# Altium project Zapper.PrjPcb (part 3 of 3)

## Sheet Filter.SchDoc
size A4; DocumentNumber: 7; SheetNumber: 7; SheetTotal: 7
Used 4 times, as channels U_Filter1, U_Filter2, U_Filter3, U_Filter4. Parts and nets are listed once, with the designators drawn on the sheet.
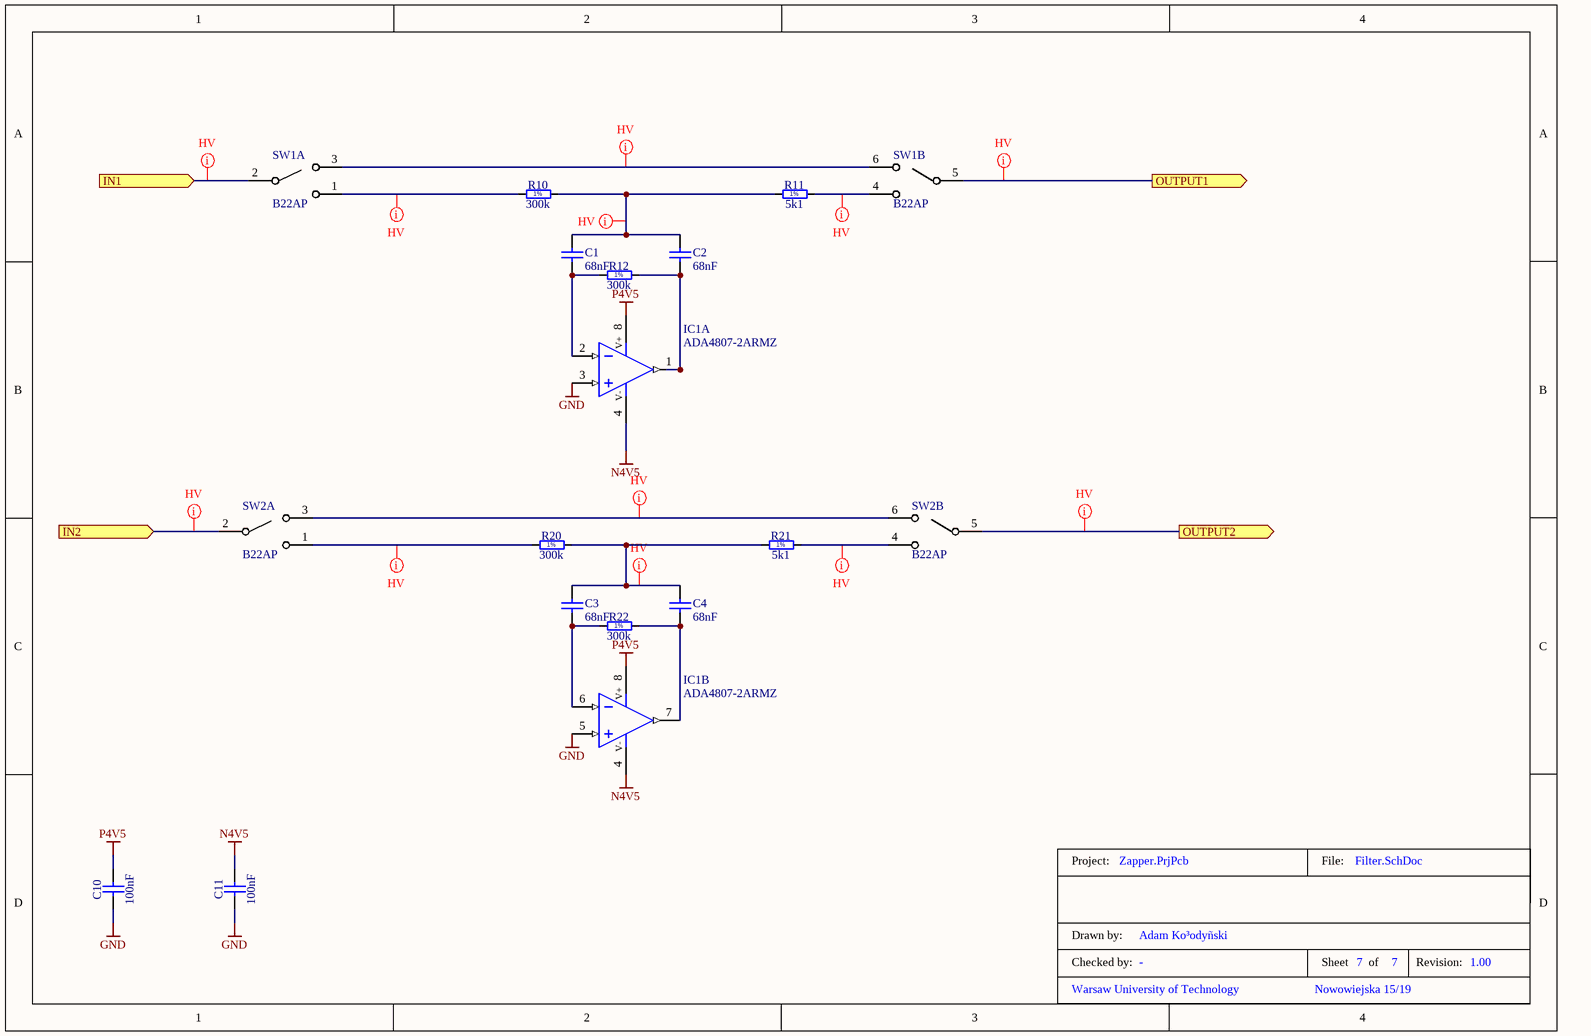
[diagram p6: Filter.SchDoc]

### Parts
C1  68nF  [CAPC2012X125 - HV]
C2  68nF  [CAPC2012X125 - HV]
C3  68nF  [CAPC2012X125 - HV]
C4  68nF  [CAPC2012X125 - HV]
C10  100nF  [CAPC1005X55N]
C11  100nF  [CAPC1005X55N]
IC1  ADA4807-2ARMZ  [SOP65P490X110-8N]  (parts A,B of 2)
R10  300k  [RESC2012X60N]
R11  5k1  [RESC1608X55N]
R12  300k  [RESC2012X60N]
R20  300k  [RESC2012X60N]
R21  5k1  [RESC1608X55N]
R22  300k  [RESC2012X60N]
SW1  B22AP  [B22AP]  (parts A,B of 2)
SW2  B22AP  [B22AP]  (parts A,B of 2)
TitleBlock7  TitleBlock  (value not drawn)  (graphical)

### Ports
IN1 (in), IN2 (in), OUTPUT1 (out), OUTPUT2 (out)

### Nets
GND: C10.1 C11.1 IC1.3(IN+) IC1.5(IN+)
N4V5: C11.2 IC1.4(V-)
P4V5: C10.2 IC1.8(V+)
IN1: SW1.2(COM) ; port IN1
IN2: SW2.2(COM) ; port IN2
OUTPUT1: SW1.5(COM) ; port OUTPUT1
OUTPUT2: SW2.5(COM) ; port OUTPUT2
NetC1_1: C1.1 IC1.2(IN-) R12.1
NetC1_2: C1.2 C2.2 R10.2 R11.1
NetC2_1: C2.1 IC1.1(OUT) R12.2
NetC3_1: C3.1 IC1.6(IN-) R22.1
NetC3_2: C3.2 C4.2 R20.2 R21.1
NetC4_1: C4.1 IC1.7(OUT) R22.2
NetR10_1: R10.1 SW1.1(UP)
NetR11_2: R11.2 SW1.4(UP)
NetR20_1: R20.1 SW2.1(UP)
NetR21_2: R21.2 SW2.4(UP)
NetSW1_3: SW1.3(DOWN) SW1.6(DOWN)
NetSW2_3: SW2.3(DOWN) SW2.6(DOWN)

### Channels
U_Filter1: designators end in _U_Filter1; ports IN1=Channel_OUT1 IN2=Channel_OUT2 OUTPUT1=Filter_OUT1 OUTPUT2=Filter_OUT2
U_Filter2: designators end in _U_Filter2; ports IN1=Channel_OUT3 IN2=Channel_OUT4 OUTPUT1=Filter_OUT3 OUTPUT2=Filter_OUT4
U_Filter3: designators end in _U_Filter3; ports IN1=Channel_OUT5 IN2=Channel_OUT6 OUTPUT1=Filter_OUT5 OUTPUT2=Filter_OUT6
U_Filter4: designators end in _U_Filter4; ports IN1=Channel_OUT7 IN2=Channel_OUT8 OUTPUT1=Filter_OUT7 OUTPUT2=Filter_OUT8

### Layout directives
net class HighVoltage: Channel_OUT1, Channel_OUT2, Filter_OUT1, Filter_OUT2, NetC1_U_Filter1_2, NetC3_U_Filter1_2, NetR10_U_Filter1_1, NetR11_U_Filter1_2, NetR20_U_Filter1_1, NetR21_U_Filter1_2, NetSW1_U_Filter1_3, NetSW2_U_Filter1_3

### Notes on the sheet
- (in symbol R0603_5K1_1%_0.1W_100PPM) 1%
- (in symbol R0805_300K_1%_0.125W_100PPM) 1%
- (in symbol TitleBlock) Project:; File:; Drawn by:; Checked by:; Sheet; of; Revision:

### Library data of the parts
C1-C4 = C0805C683KARACAUTO: CAP CER 68nF 250V X7R 10% Pad SMD 0805 125C Automotive T/R; Manufacturer 1: KEMET; Supplier 1: Digi-Key; Manufacturer Part Number 1: C0805C683KARACAUTO; Stock 1: 7245; Pricing 1: 1=0,94000, 10=0,71800, 50=0,59660, 100=0,51370, 500=0,39772, 1000=0,34247 (USD); RoHS: No; Mount: Surface Mount; Case/Package: 0805; Case Code (Imperial): 0805; Case Code (Metric): 2012; Min Operating Temperature: -55°C; Max Operating Temperature: 125°C; Packaging: Tape and Reel; Capacitance: 68nF; Tolerance: 10%; Voltage Rating: 250V; Ratings: AEC-Q200; ComponentLink1URL: https://api.kemet.com/component-edge/download/datasheet/C0805C683KARACAUTO.pdf?src-supplier=Digi-Key; ComponentLink1Description: https://api.kemet.com/component-edge/download/datasheet/C0805C683KARACAUTO.pdf?src-supplier=Digi-Key; ComponentLink2URL: http://www.farnell.com/datasheets/2621747.pdf?src-supplier=Newark; ComponentLink2Description: http://www.farnell.com/datasheets/2621747.pdf?src-supplier=Newark; Supplier Part Number 1: 399-17963-1-ND
C10 C11 = CC0402_100NF_16V_10%_X7R: Non-polarised capacitor; Part Description: SMD Multilayer Chip Ceramic Capacitor; Manufacturer: GENERIC; Manufacturer1 Part Number: GRM155R71C104KA88D; Voltage: 16V; TC: X7R; Tolerance: ±10%; Part Number: CC0402_100NF_16V_10%_X7R; Component Kind: Standard; Component Type: Standard; Pin Count: 2; Value: 100nF; Status: Not Recommended; Manufacturer Part Number: CC0402_100NF_16V_10%_X7R; Case: 0402; Mounted: Yes; Socket: No; SMD: Yes; Sense: No; Manufacturer1 Example: MURATA; Manufacturer1 ComponentHeight: 0.55mm; HelpURL: \\cern.ch\dfs\Applications\Altium\Datasheets\CC0402_X7R_MURATA_GRM.pdf; Author: CERN DEM JLC; CreateDate: 05.12.2013; LatestRevisionDate: 03.12.2007
IC1 = ADA4807-2ARMZ: Operational Amplifier, 180 Mhz, 2, 225 V/ S, 2.7V To 11V, Msop, 8; Manufacturer 1: Analog Devices; Power Supply Rejection Ratio (PSRR): 98dB; Min Supply Voltage: 3V; Voltage Gain: 130dB; Max Supply Voltage: 10V; Max Dual Supply Voltage: 5V; Common Mode Rejection Ratio: 110dB; Min Dual Supply Voltage: 1.5V; Number of Circuits: 2; Slew Rate: 145V/µs; -3db Bandwidth: 170MHz; Input Bias Current: 1.2uA; Input Offset Voltage (Vos): 20uV; Operating Supply Current: 950uA; Output Current per Channel: 106mA; Max Frequency: 100kHz; Gain Bandwidth Product: 180MHz; Output Current: 60mA; Supplier 1: Digi-Key; Manufacturer Part Number 1: ADA4807-2ARMZ; Stock 1: 0; Pricing 1: 1=4,74000, 10=4,26000, 25=4,02760, 100=3,31150, 250=2,97140, 500=2,86400, 1000=2,59550 (USD); RoHS: Yes; Mount: Surface Mount; Case/Package: MSOP; Number of Pins: 8; Contact Plating: Tin,Matte; Min Operating Temperature: -40°C; Max Operating Temperature: 125°C; Packaging: Tray; Max Input Voltage: 11V; Min Input Voltage: 2.7V; Bandwidth: 180MHz; Number of Amplifiers: 2; Length: 3.2mm; Height: 0.95mm; Width: 3.2mm; Lead Free: Contains Lead; REACH SVHC: No SVHC; ComponentLink1URL: http://www.mouser.com/ds/2/609/ADA4807-1_4807-2_4807-4-773557.pdf?src-supplier=Mouser; ComponentLink1Description: http://www.mouser.com/ds/2/609/ADA4807-1_4807-2_4807-4-773557.pdf?src-supplier=Mouser; ComponentLink2URL: http://uk.rs-online.com/webdocs/143c/0900766b8143cfda.pdf?src-supplier=RSComponents; ComponentLink2Description: http://uk.rs-online.com/webdocs/143c/0900766b8143cfda.pdf?src-supplier=RSComponents; ComponentLink3URL: http://www.farnell.com/datasheets/1971065.pdf?src-supplier=Farnell; ComponentLink3Description: http://www.farnell.com/datasheets/1971065.pdf?src-supplier=Farnell; ComponentLink4URL: http://www.analog.com/media/en/technical-documentation/data-sheets/ADA4807-1_4807-2.pdf?src-supplier=Avnet; ComponentLink4Description: http://www.analog.com/media/en/technical-documentation/data-sheets/ADA4807-1_4807-2.pdf?src-supplier=Avnet; ComponentLink5URL: http://www.farnell.com/datasheets/1971065.pdf?src-supplier=Newark; ComponentLink5Description: http://www.farnell.com/datasheets/1971065.pdf?src-supplier=Newark; ComponentLink6URL: https://www.analog.com/media/en/technical-documentation/data-sheets/ADA4807-1_4807-2_4807-4.pdf?src-supplier=Digi-Key; ComponentLink6Description: https://www.analog.com/media/en/technical-documentation/data-sheets/ADA4807-1_4807-2_4807-4.pdf?src-supplier=Digi-Key; ComponentLink7URL: http://www.farnell.com/datasheets/1971065.pdf?src-supplier=Element14; ComponentLink7Description: http://www.farnell.com/datasheets/1971065.pdf?src-supplier=Element14; Supplier Part Number 1: ADA4807-2ARMZ-ND
R10 R12 R20 R22 = R0805_300K_1%_0.125W_100PPM: Resistor - 1%; Part Description: General Purpose Thick Film Chip Resistor; Manufacturer: GENERIC; Manufacturer1 Part Number: NRC10F3003TRF; Power: 0.125W; TC: ±100ppm/°C; PressFit: No; Part Number: R0805_300K_1%_0.125W_100PPM; Component Kind: Standard; Component Type: Standard; Pin Count: 2; Value: 300k; Status: Preferred; Tolerance: ±1%; Manufacturer Part Number: R0805_300K_1%_0.125W_100PPM; Case: 0805; Mounted: Yes; Sense: No; Socket: No; SMD: Yes; Manufacturer1 Example: NIC COMPONENT; Manufacturer1 ComponentHeight: 0.6mm; HelpURL: \\cern.ch\dfs\Applications\Altium\Datasheets\R0805_NIC_NRC.pdf; Author: CERN DEM JLC; CreateDate: 03.12.2007; LatestRevisionDate: 13.03.2008
R11 R21 = R0603_5K1_1%_0.1W_100PPM: Resistor - 1%; Part Description: General Purpose Thick Film Chip Resistor; Manufacturer: GENERIC; Manufacturer1 Part Number: NRC06F5101TRF; Power: 0.1W; TC: ±100ppm/°C; PressFit: No; Part Number: R0603_5K1_1%_0.1W_100PPM; Component Kind: Standard; Component Type: Standard; Pin Count: 2; Value: 5k1; Status: Preferred; Tolerance: ±1%; Manufacturer Part Number: R0603_5K1_1%_0.1W_100PPM; Case: 0603; Mounted: Yes; Sense: No; Socket: No; SMD: Yes; Manufacturer1 Example: NIC COMPONENT; Manufacturer1 ComponentHeight: 0.55mm; HelpURL: \\cern.ch\dfs\Applications\Altium\Datasheets\R0603_NIC_NRC.pdf; Author: CERN DEM JLC; CreateDate: 03.12.2007; LatestRevisionDate: 13.03.2008
SW1 SW2 = B22AP: NKK SWITCHES         B22AP            SWITCH, TOGGLE, DPDT, 0.1A, 28VAC; Actuator Material: Brass; Current Rating: 100mA; Switch Function: On-On; Illumination Type: Non-Illuminated,Illuminated; Electrical Life: 50000Cycles; Power Rating: 400mW; Voltage Rating (AC): 28V; Actuator Type: Standard Round; Actuator Length: 10mm; Supplier 1: Digi-Key; Manufacturer 1: NKK Switches; Manufacturer Part Number 1: B22AP; Stock 1: 24; Pricing 1: 1=4,45000, 10=3,97400, 25=3,76320, 50=3,62880, 100=3,45600, 250=3,30240, 500=3,01440, 1000=2,88000 (USD); RoHS: Yes; Mount: Through Hole,PCB; Number of Pins: 1; Contact Plating: Nickel,Gold; Contact Material: Bronze,Gold; Min Operating Temperature: -30°C; Max Operating Temperature: 85°C; Package Quantity: 1; Packaging: Bulk; Termination: Solder; Throw Configuration: DPDT; Orientation: Vertical; Voltage Rating (DC): 28V; Max Current Rating: 100mA; Max Voltage Rating (AC): 28V; Max Voltage Rating (DC): 28V; Contact Current Rating: 100mA; Length: 8.8mm; Depth: 8.8mm; Lead Free: Lead Free; REACH SVHC: No SVHC; ComponentLink1URL: https://datasheet.ciiva.com/15183/getdatasheetpartid-54702-15183244.pdf?src-supplier=Verical; ComponentLink1Description: https://datasheet.ciiva.com/15183/getdatasheetpartid-54702-15183244.pdf?src-supplier=Verical; ComponentLink2URL: https://datasheet.ciiva.com/28398/1672172-28398222.pdf?src-supplier=Element14; ComponentLink2Description: https://datasheet.ciiva.com/28398/1672172-28398222.pdf?src-supplier=Element14; ComponentLink3URL: https://datasheet.ciiva.com/29337/702702-da-01-en-kipphebels-dpdt-on-on-10mm-ger-anschl-29337834.pdf?src-supplier=Conrad; ComponentLink3Description: https://datasheet.ciiva.com/29337/702702-da-01-en-kipphebels-dpdt-on-on-10mm-ger-anschl-29337834.pdf?src-supplier=Conrad; Supplier Part Number 1: 360-1015-ND; Supplier 2: Mouser; Supplier Part Number 2: 633-B22AP

## Nets that join several sheets
GND: Zapper (13 pins), LVDS (44 pins), DAC_8CH (28 pins), U_SCHMITT_LED1 (10 pins), U_SCHMITT_LED2 (10 pins), U_OutputChannel1 (15 pins), U_OutputChannel2 (15 pins), U_OutputChannel3 (15 pins), U_OutputChannel4 (15 pins), U_OutputChannel5 (15 pins), U_OutputChannel6 (15 pins), U_OutputChannel7 (15 pins), U_OutputChannel8 (15 pins), PowerSupp (48 pins), U_Filter1 (C10_U_Filter1.1 C11_U_Filter1.1 IC1_U_Filter1.3 IC1_U_Filter1.5), U_Filter2 (C10_U_Filter2.1 C11_U_Filter2.1 IC1_U_Filter2.3 IC1_U_Filter2.5), U_Filter3 (C10_U_Filter3.1 C11_U_Filter3.1 IC1_U_Filter3.3 IC1_U_Filter3.5), U_Filter4 (C10_U_Filter4.1 C11_U_Filter4.1 IC1_U_Filter4.3 IC1_U_Filter4.5)
N4V5: DAC_8CH (7 pins), U_OutputChannel1 (C11_U_OutputChannel1.2 C20_U_OutputChannel1.2 IC1_U_OutputChannel1.4 IC2_U_OutputChannel1.4), U_OutputChannel2 (C11_U_OutputChannel2.2 C20_U_OutputChannel2.2 IC1_U_OutputChannel2.4 IC2_U_OutputChannel2.4), U_OutputChannel3 (C11_U_OutputChannel3.2 C20_U_OutputChannel3.2 IC1_U_OutputChannel3.4 IC2_U_OutputChannel3.4), U_OutputChannel4 (C11_U_OutputChannel4.2 C20_U_OutputChannel4.2 IC1_U_OutputChannel4.4 IC2_U_OutputChannel4.4), U_OutputChannel5 (C11_U_OutputChannel5.2 C20_U_OutputChannel5.2 IC1_U_OutputChannel5.4 IC2_U_OutputChannel5.4), U_OutputChannel6 (C11_U_OutputChannel6.2 C20_U_OutputChannel6.2 IC1_U_OutputChannel6.4 IC2_U_OutputChannel6.4), U_OutputChannel7 (C11_U_OutputChannel7.2 C20_U_OutputChannel7.2 IC1_U_OutputChannel7.4 IC2_U_OutputChannel7.4), U_OutputChannel8 (C11_U_OutputChannel8.2 C20_U_OutputChannel8.2 IC1_U_OutputChannel8.4 IC2_U_OutputChannel8.4), PowerSupp (7 pins), U_Filter1 (C11_U_Filter1.2 IC1_U_Filter1.4), U_Filter2 (C11_U_Filter2.2 IC1_U_Filter2.4), U_Filter3 (C11_U_Filter3.2 IC1_U_Filter3.4), U_Filter4 (C11_U_Filter4.2 IC1_U_Filter4.4)
P3V3: LVDS (31 pins), DAC_8CH (IC5.3 IC5.4 L0.1), U_SCHMITT_LED1 (6 pins), U_SCHMITT_LED2 (6 pins), PowerSupp (7 pins)
P4V5: PowerSupp (7 pins), U_Filter1 (C10_U_Filter1.2 IC1_U_Filter1.8), U_Filter2 (C10_U_Filter2.2 IC1_U_Filter2.8), U_Filter3 (C10_U_Filter3.2 IC1_U_Filter3.8), U_Filter4 (C10_U_Filter4.2 IC1_U_Filter4.8)
P5V0: DAC_8CH (C10.2 C11.1 IC6.2), PowerSupp (C42.2 C43.2 IC10.1 L3.2)
P11V5: DAC_8CH (6 pins), U_OutputChannel1 (C21_U_OutputChannel1.2 IC2_U_OutputChannel1.7), U_OutputChannel2 (C21_U_OutputChannel2.2 IC2_U_OutputChannel2.7), U_OutputChannel3 (C21_U_OutputChannel3.2 IC2_U_OutputChannel3.7), U_OutputChannel4 (C21_U_OutputChannel4.2 IC2_U_OutputChannel4.7), U_OutputChannel5 (C21_U_OutputChannel5.2 IC2_U_OutputChannel5.7), U_OutputChannel6 (C21_U_OutputChannel6.2 IC2_U_OutputChannel6.7), U_OutputChannel7 (C21_U_OutputChannel7.2 IC2_U_OutputChannel7.7), U_OutputChannel8 (C21_U_OutputChannel8.2 IC2_U_OutputChannel8.7), PowerSupp (7 pins)
P12V0: LVDS (J1.28 J1.29), PowerSupp (6 pins)
P200V0: U_OutputChannel1 (C10_U_OutputChannel1.2 IC1_U_OutputChannel1.7), U_OutputChannel2 (C10_U_OutputChannel2.2 IC1_U_OutputChannel2.7), U_OutputChannel3 (C10_U_OutputChannel3.2 IC1_U_OutputChannel3.7), U_OutputChannel4 (C10_U_OutputChannel4.2 IC1_U_OutputChannel4.7), U_OutputChannel5 (C10_U_OutputChannel5.2 IC1_U_OutputChannel5.7), U_OutputChannel6 (C10_U_OutputChannel6.2 IC1_U_OutputChannel6.7), U_OutputChannel7 (C10_U_OutputChannel7.2 IC1_U_OutputChannel7.7), U_OutputChannel8 (C10_U_OutputChannel8.2 IC1_U_OutputChannel8.7), PowerSupp (C50.2 C51.2 L5.2 TP12.1)
BUSY: LVDS (IC2.28), DAC_8CH (IC41.5 IC42.3 TP7.1)
Channel_OUT1: U_OutputChannel1 (R6_U_OutputChannel1.2 R10_U_OutputChannel1.2), U_Filter1 (SW1_U_Filter1.2)
Channel_OUT2: U_OutputChannel2 (R6_U_OutputChannel2.2 R10_U_OutputChannel2.2), U_Filter1 (SW2_U_Filter1.2)
Channel_OUT3: U_OutputChannel3 (R6_U_OutputChannel3.2 R10_U_OutputChannel3.2), U_Filter2 (SW1_U_Filter2.2)
Channel_OUT4: U_OutputChannel4 (R6_U_OutputChannel4.2 R10_U_OutputChannel4.2), U_Filter2 (SW2_U_Filter2.2)
Channel_OUT5: U_OutputChannel5 (R6_U_OutputChannel5.2 R10_U_OutputChannel5.2), U_Filter3 (SW1_U_Filter3.2)
Channel_OUT6: U_OutputChannel6 (R6_U_OutputChannel6.2 R10_U_OutputChannel6.2), U_Filter3 (SW2_U_Filter3.2)
Channel_OUT7: U_OutputChannel7 (R6_U_OutputChannel7.2 R10_U_OutputChannel7.2), U_Filter4 (SW1_U_Filter4.2)
Channel_OUT8: U_OutputChannel8 (R6_U_OutputChannel8.2 R10_U_OutputChannel8.2), U_Filter4 (SW2_U_Filter4.2)
Channel_TMP1: U_SCHMITT_LED1 (IC1_U_SCHMITT_LED1.13), U_OutputChannel1 (IC1_U_OutputChannel1.5 IC1_U_OutputChannel1.8 R9_U_OutputChannel1.2)
Channel_TMP2: U_SCHMITT_LED1 (IC1_U_SCHMITT_LED1.9), U_OutputChannel2 (IC1_U_OutputChannel2.5 IC1_U_OutputChannel2.8 R9_U_OutputChannel2.2)
Channel_TMP3: U_SCHMITT_LED1 (IC1_U_SCHMITT_LED1.6), U_OutputChannel3 (IC1_U_OutputChannel3.5 IC1_U_OutputChannel3.8 R9_U_OutputChannel3.2)
Channel_TMP4: U_SCHMITT_LED1 (IC1_U_SCHMITT_LED1.2), U_OutputChannel4 (IC1_U_OutputChannel4.5 IC1_U_OutputChannel4.8 R9_U_OutputChannel4.2)
Channel_TMP5: U_SCHMITT_LED2 (IC1_U_SCHMITT_LED2.13), U_OutputChannel5 (IC1_U_OutputChannel5.5 IC1_U_OutputChannel5.8 R9_U_OutputChannel5.2)
Channel_TMP6: U_SCHMITT_LED2 (IC1_U_SCHMITT_LED2.9), U_OutputChannel6 (IC1_U_OutputChannel6.5 IC1_U_OutputChannel6.8 R9_U_OutputChannel6.2)
Channel_TMP7: U_SCHMITT_LED2 (IC1_U_SCHMITT_LED2.6), U_OutputChannel7 (IC1_U_OutputChannel7.5 IC1_U_OutputChannel7.8 R9_U_OutputChannel7.2)
Channel_TMP8: U_SCHMITT_LED2 (IC1_U_SCHMITT_LED2.2), U_OutputChannel8 (IC1_U_OutputChannel8.5 IC1_U_OutputChannel8.8 R9_U_OutputChannel8.2)
CLR: LVDS (IC2.26), DAC_8CH (IC41.2 IC42.56 TP8.1)
Filter_OUT1: Zapper (J3.8), U_Filter1 (SW1_U_Filter1.5)
Filter_OUT2: Zapper (J3.7), U_Filter1 (SW2_U_Filter1.5)
Filter_OUT3: Zapper (J3.6), U_Filter2 (SW1_U_Filter2.5)
Filter_OUT4: Zapper (J3.5), U_Filter2 (SW2_U_Filter2.5)
Filter_OUT5: Zapper (J3.4), U_Filter3 (SW1_U_Filter3.5)
Filter_OUT6: Zapper (J3.3), U_Filter3 (SW2_U_Filter3.5)
Filter_OUT7: Zapper (J3.2), U_Filter4 (SW1_U_Filter4.5)
Filter_OUT8: Zapper (J3.1), U_Filter4 (SW2_U_Filter4.5)
LDAC: LVDS (IC2.33), DAC_8CH (IC41.1 IC42.55 TP9.1)
PEC: LVDS (IC2.35), DAC_8CH (IC41.48 IC42.50 TP10.1)
SCLK: LVDS (IC1.36), DAC_8CH (IC41.46 IC42.48 TP3.1)
SDI: LVDS (IC1.33), DAC_8CH (IC41.47 IC42.49 TP4.1)
SDO: LVDS (IC1.28), DAC_8CH (IC41.49 IC42.51 TP5.1)
SYNC: LVDS (IC1.26), DAC_8CH (IC41.45 IC42.47 TP6.1)
VOUT1: DAC_8CH (IC41.34 IC42.36), U_OutputChannel1 (R1_U_OutputChannel1.1)
VOUT2: DAC_8CH (IC41.35 IC42.37), U_OutputChannel2 (R1_U_OutputChannel2.1)
VOUT3: DAC_8CH (IC41.36 IC42.38), U_OutputChannel3 (R1_U_OutputChannel3.1)
VOUT4: DAC_8CH (IC41.37 IC42.39), U_OutputChannel4 (R1_U_OutputChannel4.1)
VOUT5: DAC_8CH (IC41.15 IC42.17), U_OutputChannel5 (R1_U_OutputChannel5.1)
VOUT6: DAC_8CH (IC41.16 IC42.18), U_OutputChannel6 (R1_U_OutputChannel6.1)
VOUT7: DAC_8CH (IC41.17 IC42.19), U_OutputChannel7 (R1_U_OutputChannel7.1)
VOUT8: DAC_8CH (IC41.18 IC42.20), U_OutputChannel8 (R1_U_OutputChannel8.1)

## Assembly variants
AD5362BSTZ/ADA4841-2: not fitted IC42; alternate parts IC1_U_Filter1 -> ADA4841-2YRMZ, IC1_U_Filter2 -> ADA4841-2YRMZ, IC1_U_Filter3 -> ADA4841-2YRMZ, IC1_U_Filter4 -> ADA4841-2YRMZ
AD5362BCPZ: not fitted IC41